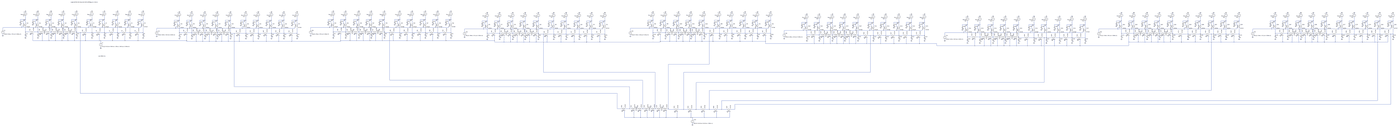
[diagram p0: schematic sambaall.asc, whole sheet]
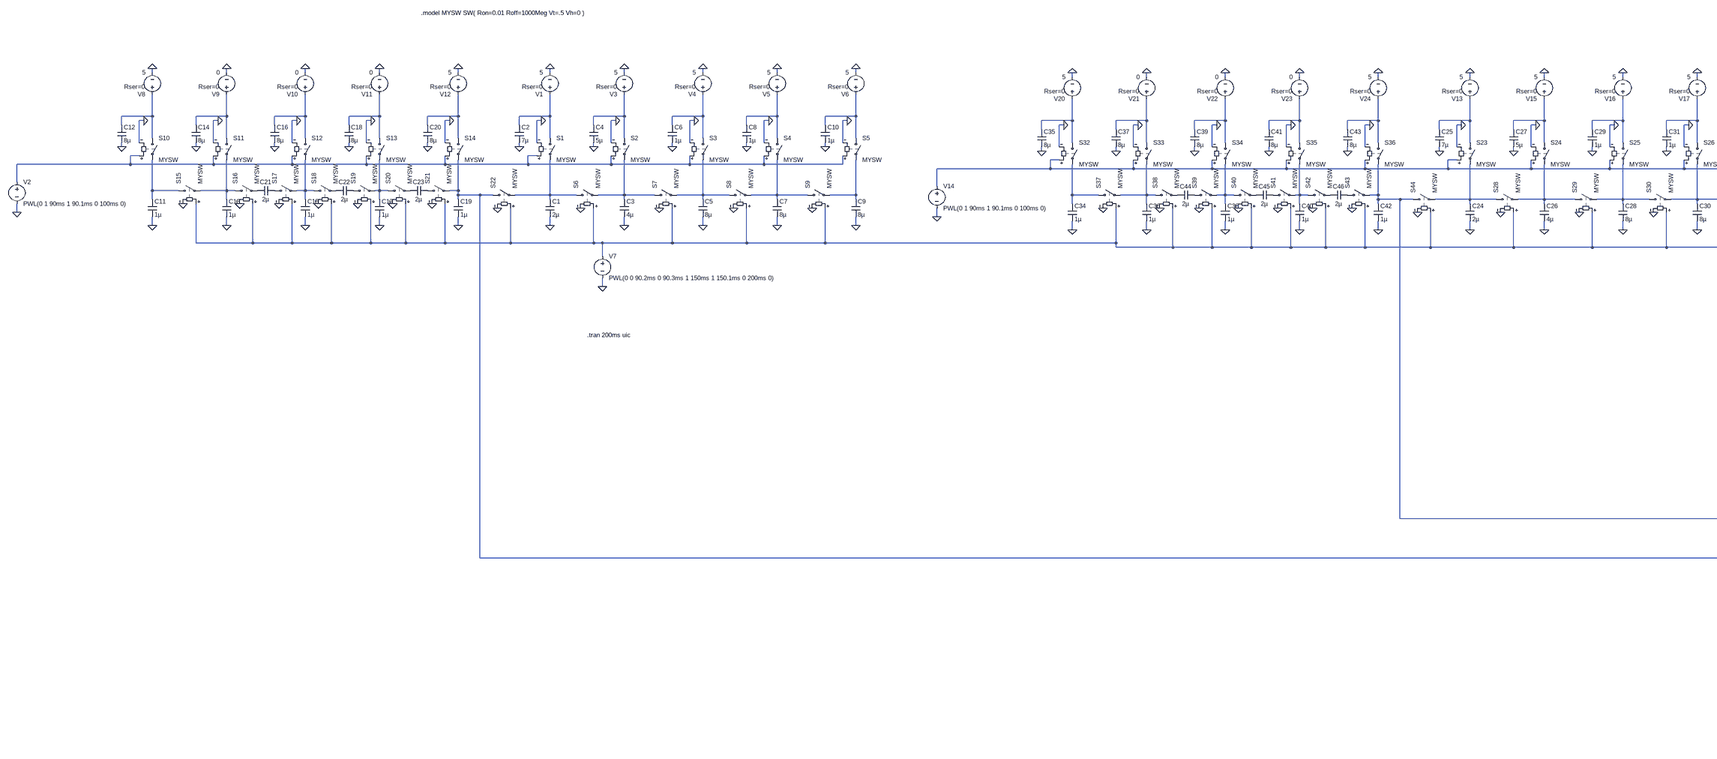
[diagram p1: schematic sambaall.asc, part, row 1 of 1, column 1 of 5]
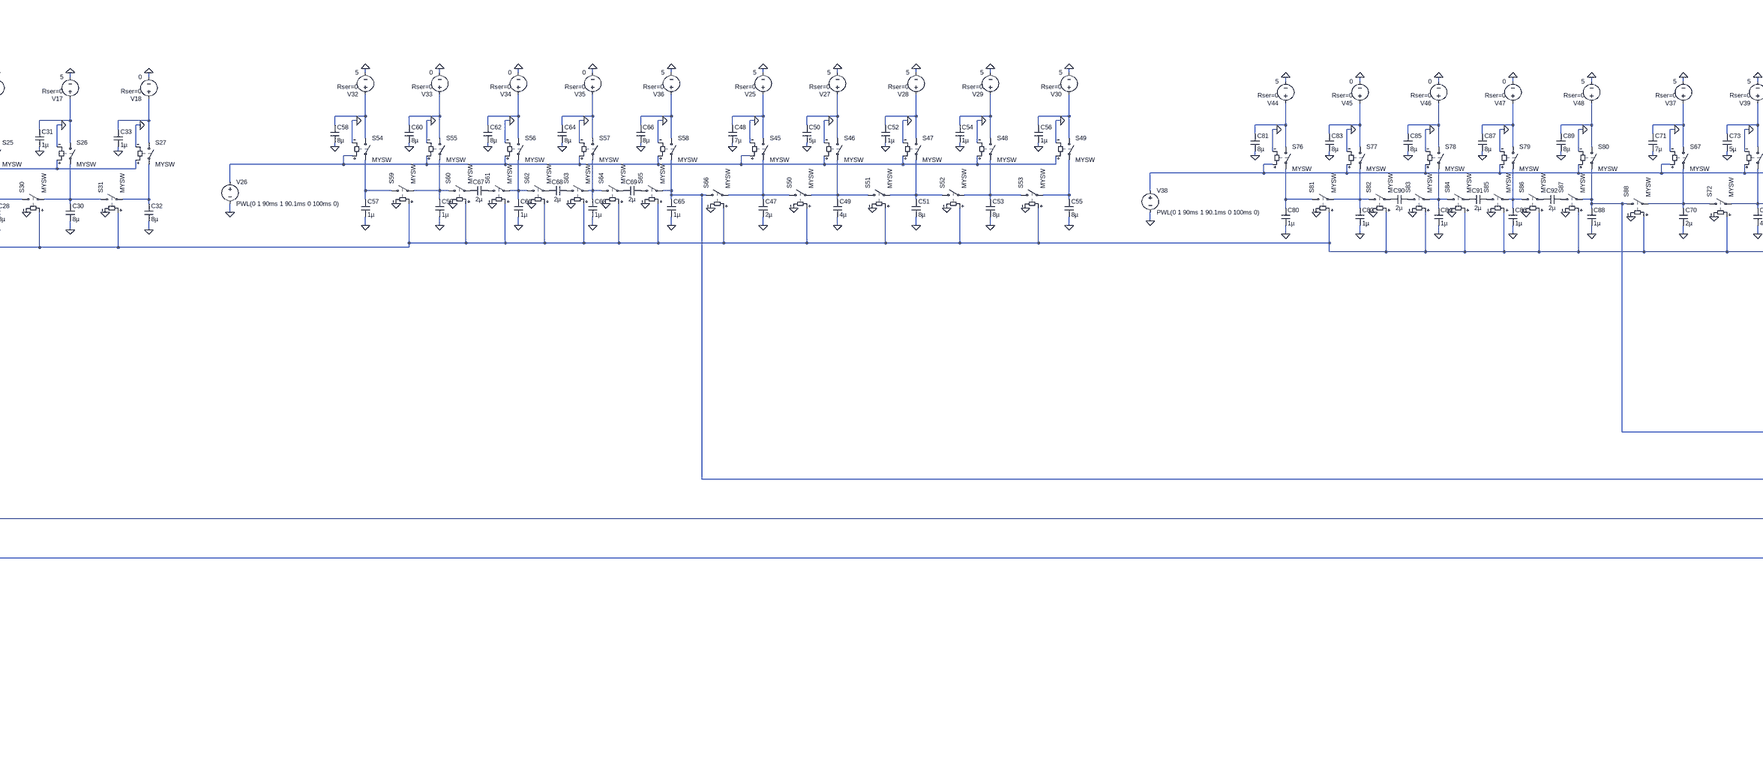
[diagram p2: schematic sambaall.asc, part, row 1 of 1, column 2 of 5]
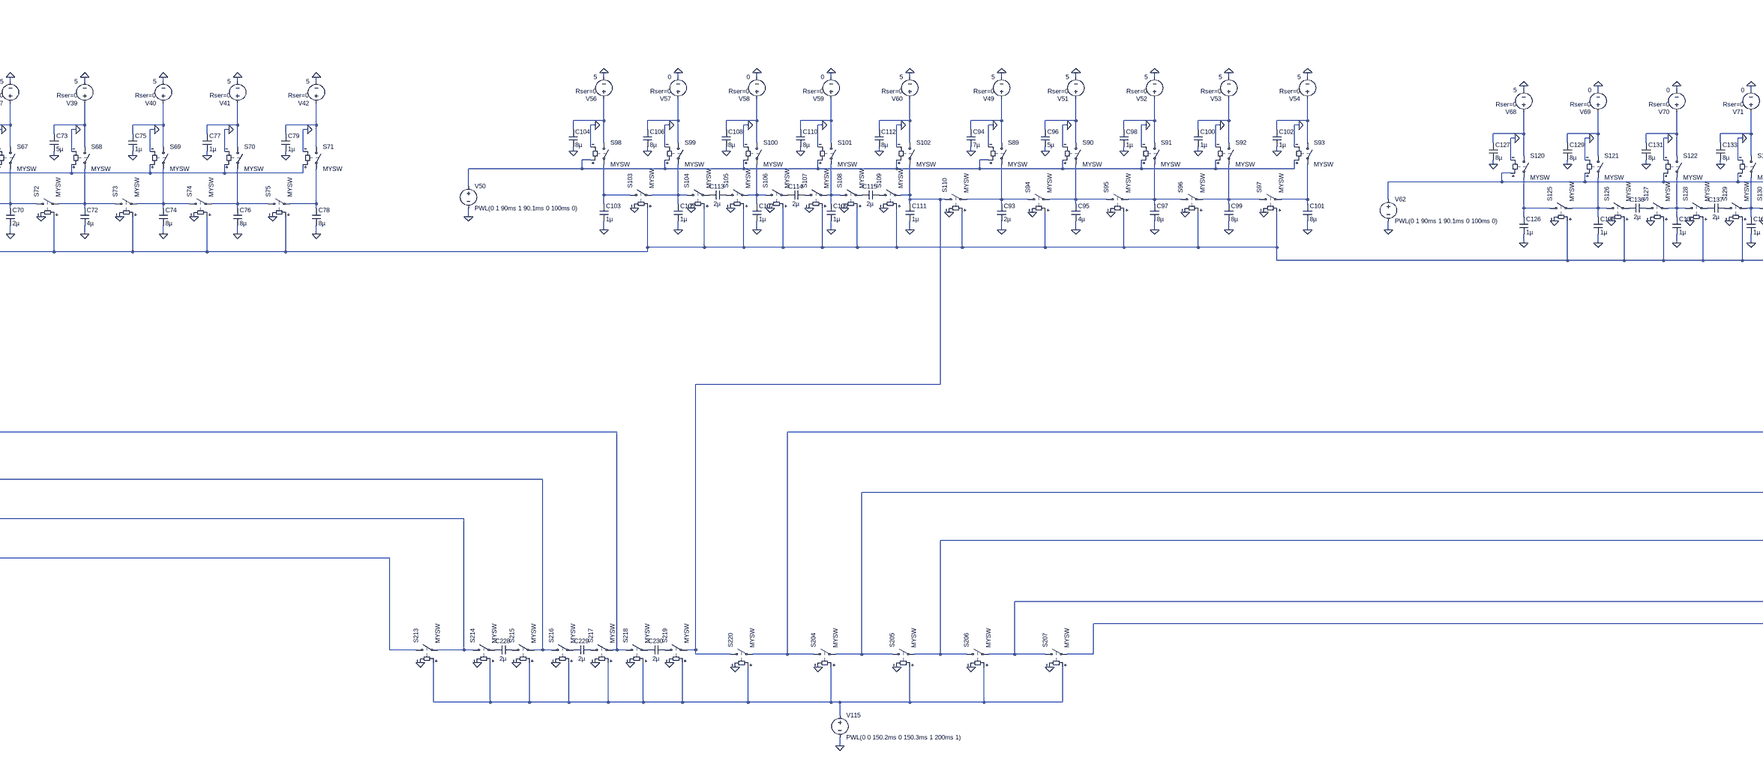
[diagram p3: schematic sambaall.asc, part, row 1 of 1, column 3 of 5]
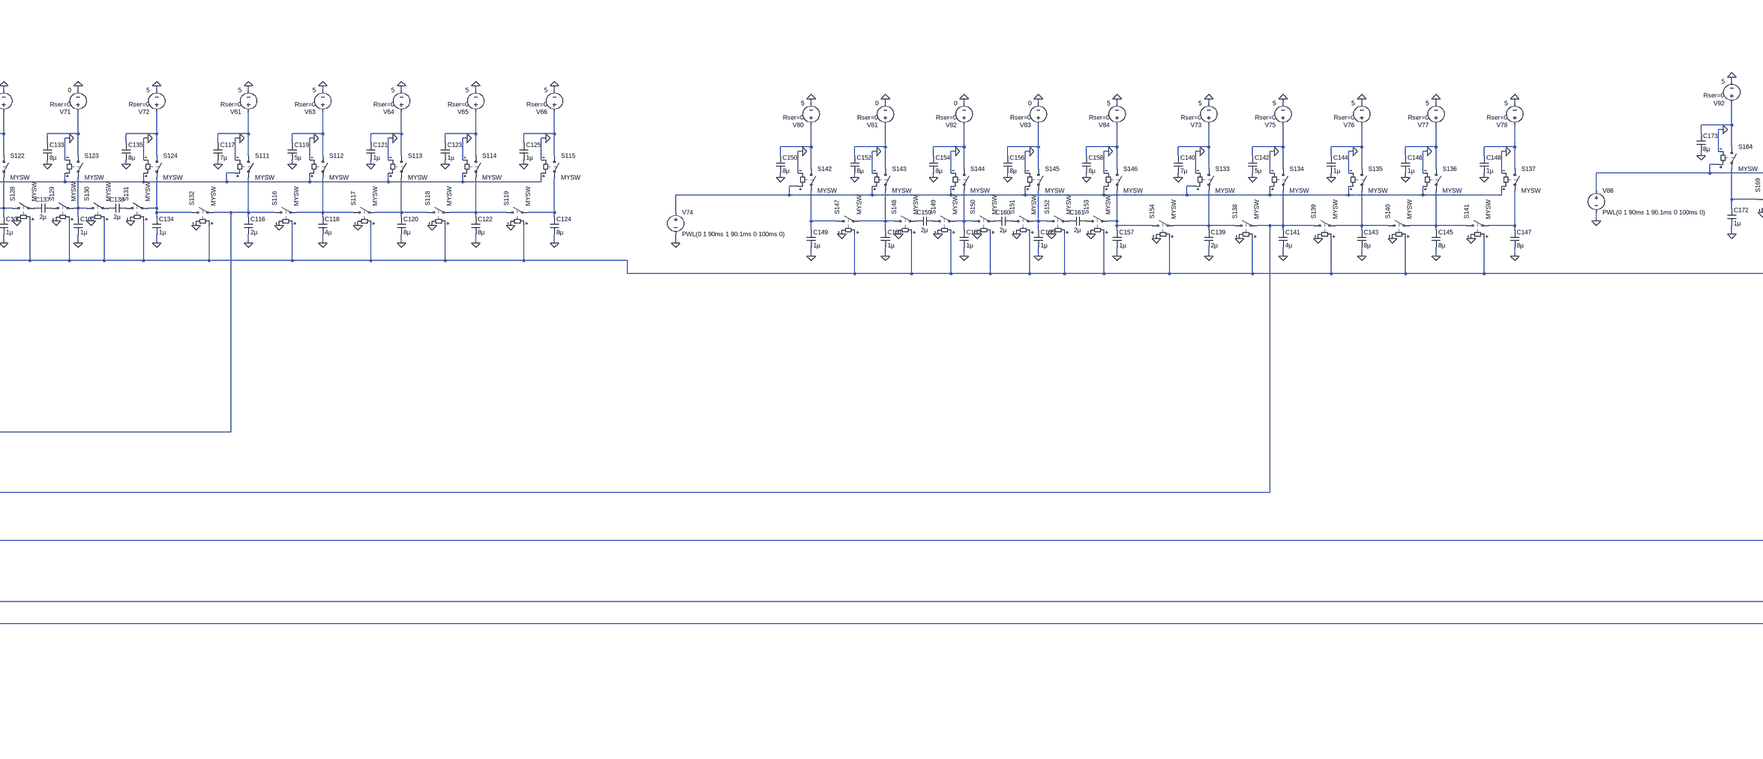
[diagram p4: schematic sambaall.asc, part, row 1 of 1, column 4 of 5]
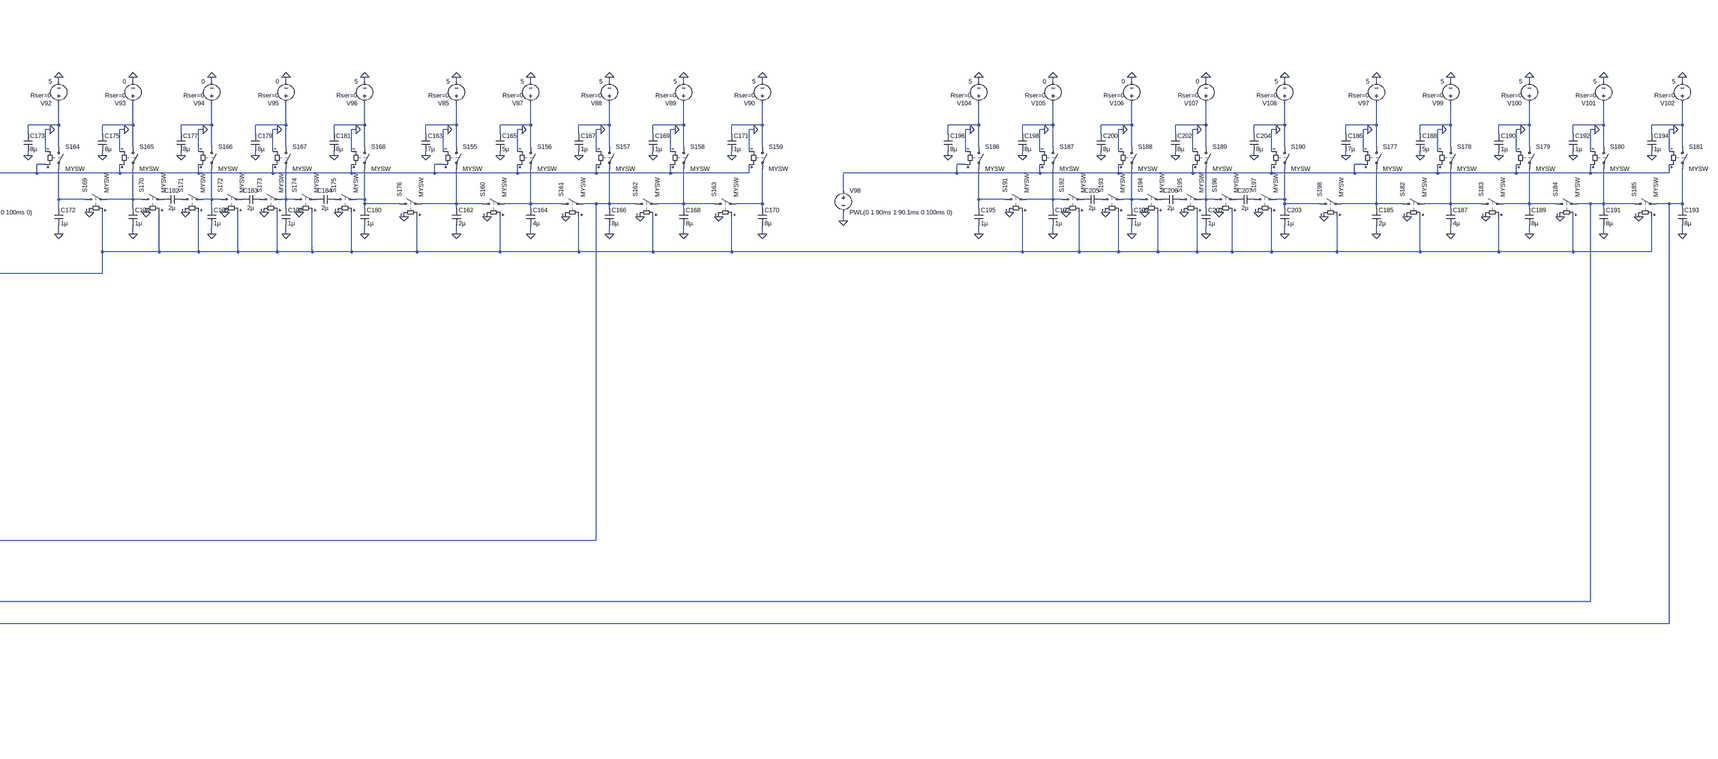
[diagram p5: schematic sambaall.asc, part, row 1 of 1, column 5 of 5]
* sambaall.asc
C1 N110 0 2µ
C2 N006 0 7µ
V1 N006 0 5 Rser=0
V2 N091 0 PWL(0 1 90ms 1 90.1ms 0 100ms 0)
S1 N006 N110 N091 0 MYSW
C3 N111 0 4µ
C4 N007 0 5µ
S2 N007 N111 N091 0 MYSW
C5 N112 0 8µ
C6 N008 0 1µ
S3 N008 N112 N091 0 MYSW
C7 N113 0 8µ
C8 N009 0 1µ
S4 N009 N113 N091 0 MYSW
C9 N114 0 8µ
C10 N010 0 1µ
S5 N010 N114 N091 0 MYSW
S6 N110 N111 N190 0 MYSW
V3 N007 0 5 Rser=0
V4 N008 0 5 Rser=0
V5 N009 0 5 Rser=0
V6 N010 0 5 Rser=0
S7 N111 N112 N190 0 MYSW
S8 N112 N113 N190 0 MYSW
S9 N113 N114 N190 0 MYSW
V7 N190 0 PWL(0 0 90.2ms 0 90.3ms 1 150ms 1 150.1ms 0 200ms 0)
C11 N100 0 1µ
C12 N001 0 8µ
V8 N001 0 5 Rser=0
S10 N001 N100 N091 0 MYSW
C13 N101 0 1µ
C14 N002 0 8µ
S11 N002 N101 N091 0 MYSW
C15 N102 0 1µ
C16 N003 0 8µ
S12 N003 N102 N091 0 MYSW
C17 N103 0 1µ
C18 N004 0 8µ
S13 N004 N103 N091 0 MYSW
C19 N104 0 1µ
C20 N005 0 8µ
S14 N005 N104 N091 0 MYSW
S15 N100 N101 N190 0 MYSW
V9 N002 0 0 Rser=0
V10 N003 0 0 Rser=0
V11 N004 0 0 Rser=0
V12 N005 0 5 Rser=0
S16 N101 P001 N190 0 MYSW
C21 P002 P001 2µ
S17 P002 N102 N190 0 MYSW
S18 N102 P003 N190 0 MYSW
C22 P004 P003 2µ
S19 P004 N103 N190 0 MYSW
S20 N103 P005 N190 0 MYSW
C23 P006 P005 2µ
S21 P006 N104 N190 0 MYSW
S22 N104 N110 N190 0 MYSW
C24 N130 0 2µ
C25 N026 0 7µ
V13 N026 0 5 Rser=0
V14 N093 0 PWL(0 1 90ms 1 90.1ms 0 100ms 0)
S23 N026 N130 N093 0 MYSW
C26 N131 0 4µ
C27 N027 0 5µ
S24 N027 N131 N093 0 MYSW
C28 N132 0 8µ
C29 N028 0 1µ
S25 N028 N132 N093 0 MYSW
C30 N133 0 8µ
C31 N029 0 1µ
S26 N029 N133 N093 0 MYSW
C32 N134 0 8µ
C33 N030 0 1µ
S27 N030 N134 N093 0 MYSW
S28 N130 N131 N190 0 MYSW
V15 N027 0 5 Rser=0
V16 N028 0 5 Rser=0
V17 N029 0 5 Rser=0
V18 N030 0 0 Rser=0
S29 N131 N132 N190 0 MYSW
S30 N132 N133 N190 0 MYSW
S31 N133 N134 N190 0 MYSW
C34 N115 0 1µ
C35 N021 0 8µ
V20 N021 0 5 Rser=0
S32 N021 N115 N093 0 MYSW
C36 N116 0 1µ
C37 N022 0 8µ
S33 N022 N116 N093 0 MYSW
C38 N117 0 1µ
C39 N023 0 8µ
S34 N023 N117 N093 0 MYSW
C40 N118 0 1µ
C41 N024 0 8µ
S35 N024 N118 N093 0 MYSW
C42 N119 0 1µ
C43 N025 0 8µ
S36 N025 N119 N093 0 MYSW
S37 N115 N116 N190 0 MYSW
V21 N022 0 0 Rser=0
V22 N023 0 0 Rser=0
V23 N024 0 0 Rser=0
V24 N025 0 5 Rser=0
S38 N116 P007 N190 0 MYSW
C44 P008 P007 2µ
S39 P008 N117 N190 0 MYSW
S40 N117 P009 N190 0 MYSW
C45 P010 P009 2µ
S41 P010 N118 N190 0 MYSW
S42 N118 P011 N190 0 MYSW
C46 P012 P011 2µ
S43 P012 N119 N190 0 MYSW
S44 N119 N130 N190 0 MYSW
C47 N120 0 2µ
C48 N016 0 7µ
V25 N016 0 5 Rser=0
V26 N092 0 PWL(0 1 90ms 1 90.1ms 0 100ms 0)
S45 N016 N120 N092 0 MYSW
C49 N121 0 4µ
C50 N017 0 5µ
S46 N017 N121 N092 0 MYSW
C51 N122 0 8µ
C52 N018 0 1µ
S47 N018 N122 N092 0 MYSW
C53 N123 0 8µ
C54 N019 0 1µ
S48 N019 N123 N092 0 MYSW
C55 N124 0 8µ
C56 N020 0 1µ
S49 N020 N124 N092 0 MYSW
S50 N120 N121 N190 0 MYSW
V27 N017 0 5 Rser=0
V28 N018 0 5 Rser=0
V29 N019 0 5 Rser=0
V30 N020 0 5 Rser=0
S51 N121 N122 N190 0 MYSW
S52 N122 N123 N190 0 MYSW
S53 N123 N124 N190 0 MYSW
C57 N105 0 1µ
C58 N011 0 8µ
V32 N011 0 5 Rser=0
S54 N011 N105 N092 0 MYSW
C59 N106 0 1µ
C60 N012 0 8µ
S55 N012 N106 N092 0 MYSW
C61 N107 0 1µ
C62 N013 0 8µ
S56 N013 N107 N092 0 MYSW
C63 N108 0 1µ
C64 N014 0 8µ
S57 N014 N108 N092 0 MYSW
C65 N109 0 1µ
C66 N015 0 8µ
S58 N015 N109 N092 0 MYSW
S59 N105 N106 N190 0 MYSW
V33 N012 0 0 Rser=0
V34 N013 0 0 Rser=0
V35 N014 0 0 Rser=0
V36 N015 0 5 Rser=0
S60 N106 P013 N190 0 MYSW
C67 P014 P013 2µ
S61 P014 N107 N190 0 MYSW
S62 N107 P015 N190 0 MYSW
C68 P016 P015 2µ
S63 P016 N108 N190 0 MYSW
S64 N108 P017 N190 0 MYSW
C69 P018 P017 2µ
S65 P018 N109 N190 0 MYSW
S66 N109 N120 N190 0 MYSW
C70 N155 0 2µ
C71 N046 0 7µ
V37 N046 0 5 Rser=0
V38 N095 0 PWL(0 1 90ms 1 90.1ms 0 100ms 0)
S67 N046 N155 N095 0 MYSW
C72 N156 0 4µ
C73 N047 0 5µ
S68 N047 N156 N095 0 MYSW
C74 N157 0 8µ
C75 N048 0 1µ
S69 N048 N157 N095 0 MYSW
C76 N158 0 8µ
C77 N049 0 1µ
S70 N049 N158 N095 0 MYSW
C78 N159 0 8µ
C79 N050 0 1µ
S71 N050 N159 N095 0 MYSW
S72 N155 N156 N190 0 MYSW
V39 N047 0 5 Rser=0
V40 N048 0 5 Rser=0
V41 N049 0 5 Rser=0
V42 N050 0 5 Rser=0
S73 N156 N157 N190 0 MYSW
S74 N157 N158 N190 0 MYSW
S75 N158 N159 N190 0 MYSW
C80 N135 0 1µ
C81 N041 0 8µ
V44 N041 0 5 Rser=0
S76 N041 N135 N095 0 MYSW
C82 N136 0 1µ
C83 N042 0 8µ
S77 N042 N136 N095 0 MYSW
C84 N137 0 1µ
C85 N043 0 8µ
S78 N043 N137 N095 0 MYSW
C86 N138 0 1µ
C87 N044 0 8µ
S79 N044 N138 N095 0 MYSW
C88 N139 0 1µ
C89 N045 0 8µ
S80 N045 N139 N095 0 MYSW
S81 N135 N136 N190 0 MYSW
V45 N042 0 0 Rser=0
V46 N043 0 0 Rser=0
V47 N044 0 0 Rser=0
V48 N045 0 5 Rser=0
S82 N136 P019 N190 0 MYSW
C90 P020 P019 2µ
S83 P020 N137 N190 0 MYSW
S84 N137 P021 N190 0 MYSW
C91 P022 P021 2µ
S85 P022 N138 N190 0 MYSW
S86 N138 P023 N190 0 MYSW
C92 P024 P023 2µ
S87 P024 N139 N190 0 MYSW
S88 N139 N155 N190 0 MYSW
C93 N140 0 2µ
C94 N036 0 7µ
V49 N036 0 5 Rser=0
V50 N094 0 PWL(0 1 90ms 1 90.1ms 0 100ms 0)
S89 N036 N140 N094 0 MYSW
C95 N141 0 4µ
C96 N037 0 5µ
S90 N037 N141 N094 0 MYSW
C97 N142 0 8µ
C98 N038 0 1µ
S91 N038 N142 N094 0 MYSW
C99 N143 0 8µ
C100 N039 0 1µ
S92 N039 N143 N094 0 MYSW
C101 N144 0 8µ
C102 N040 0 1µ
S93 N040 N144 N094 0 MYSW
S94 N140 N141 N190 0 MYSW
V51 N037 0 5 Rser=0
V52 N038 0 5 Rser=0
V53 N039 0 5 Rser=0
V54 N040 0 5 Rser=0
S95 N141 N142 N190 0 MYSW
S96 N142 N143 N190 0 MYSW
S97 N143 N144 N190 0 MYSW
C103 N125 0 1µ
C104 N031 0 8µ
V56 N031 0 5 Rser=0
S98 N031 N125 N094 0 MYSW
C105 N126 0 1µ
C106 N032 0 8µ
S99 N032 N126 N094 0 MYSW
C107 N127 0 1µ
C108 N033 0 8µ
S100 N033 N127 N094 0 MYSW
C109 N128 0 1µ
C110 N034 0 8µ
S101 N034 N128 N094 0 MYSW
C111 N129 0 1µ
C112 N035 0 8µ
S102 N035 N129 N094 0 MYSW
S103 N125 N126 N190 0 MYSW
V57 N032 0 0 Rser=0
V58 N033 0 0 Rser=0
V59 N034 0 0 Rser=0
V60 N035 0 5 Rser=0
S104 N126 P025 N190 0 MYSW
C113 P026 P025 2µ
S105 P026 N127 N190 0 MYSW
S106 N127 P027 N190 0 MYSW
C114 P028 P027 2µ
S107 P028 N128 N190 0 MYSW
S108 N128 P029 N190 0 MYSW
C115 P030 P029 2µ
S109 P030 N129 N190 0 MYSW
S110 N129 N140 N190 0 MYSW
C116 N175 0 2µ
C117 N076 0 7µ
V61 N076 0 5 Rser=0
V62 N098 0 PWL(0 1 90ms 1 90.1ms 0 100ms 0)
S111 N076 N175 N098 0 MYSW
C118 N176 0 4µ
C119 N077 0 5µ
S112 N077 N176 N098 0 MYSW
C120 N177 0 8µ
C121 N078 0 1µ
S113 N078 N177 N098 0 MYSW
C122 N178 0 8µ
C123 N079 0 1µ
S114 N079 N178 N098 0 MYSW
C124 N179 0 8µ
C125 N080 0 1µ
S115 N080 N179 N098 0 MYSW
S116 N175 N176 N190 0 MYSW
V63 N077 0 5 Rser=0
V64 N078 0 5 Rser=0
V65 N079 0 5 Rser=0
V66 N080 0 5 Rser=0
S117 N176 N177 N190 0 MYSW
S118 N177 N178 N190 0 MYSW
S119 N178 N179 N190 0 MYSW
C126 N170 0 1µ
C127 N071 0 8µ
V68 N071 0 5 Rser=0
S120 N071 N170 N098 0 MYSW
C128 N171 0 1µ
C129 N072 0 8µ
S121 N072 N171 N098 0 MYSW
C130 N172 0 1µ
C131 N073 0 8µ
S122 N073 N172 N098 0 MYSW
C132 N173 0 1µ
C133 N074 0 8µ
S123 N074 N173 N098 0 MYSW
C134 N174 0 1µ
C135 N075 0 8µ
S124 N075 N174 N098 0 MYSW
S125 N170 N171 N190 0 MYSW
V69 N072 0 0 Rser=0
V70 N073 0 0 Rser=0
V71 N074 0 0 Rser=0
V72 N075 0 5 Rser=0
S126 N171 P031 N190 0 MYSW
C136 P032 P031 2µ
S127 P032 N172 N190 0 MYSW
S128 N172 P033 N190 0 MYSW
C137 P034 P033 2µ
S129 P034 N173 N190 0 MYSW
S130 N173 P035 N190 0 MYSW
C138 P036 P035 2µ
S131 P036 N174 N190 0 MYSW
S132 N174 N175 N190 0 MYSW
C139 N185 0 2µ
C140 N086 0 7µ
V73 N086 0 5 Rser=0
V74 N099 0 PWL(0 1 90ms 1 90.1ms 0 100ms 0)
S133 N086 N185 N099 0 MYSW
C141 N186 0 4µ
C142 N087 0 5µ
S134 N087 N186 N099 0 MYSW
C143 N187 0 8µ
C144 N088 0 1µ
S135 N088 N187 N099 0 MYSW
C145 N188 0 8µ
C146 N089 0 1µ
S136 N089 N188 N099 0 MYSW
C147 N189 0 8µ
C148 N090 0 1µ
S137 N090 N189 N099 0 MYSW
S138 N185 N186 N190 0 MYSW
V75 N087 0 5 Rser=0
V76 N088 0 5 Rser=0
V77 N089 0 5 Rser=0
V78 N090 0 5 Rser=0
S139 N186 N187 N190 0 MYSW
S140 N187 N188 N190 0 MYSW
S141 N188 N189 N190 0 MYSW
C149 N180 0 1µ
C150 N081 0 8µ
V80 N081 0 5 Rser=0
S142 N081 N180 N099 0 MYSW
C151 N181 0 1µ
C152 N082 0 8µ
S143 N082 N181 N099 0 MYSW
C153 N182 0 1µ
C154 N083 0 8µ
S144 N083 N182 N099 0 MYSW
C155 N183 0 1µ
C156 N084 0 8µ
S145 N084 N183 N099 0 MYSW
C157 N184 0 1µ
C158 N085 0 8µ
S146 N085 N184 N099 0 MYSW
S147 N180 N181 N190 0 MYSW
V81 N082 0 0 Rser=0
V82 N083 0 0 Rser=0
V83 N084 0 0 Rser=0
V84 N085 0 5 Rser=0
S148 N181 P037 N190 0 MYSW
C159 P038 P037 2µ
S149 P038 N182 N190 0 MYSW
S150 N182 P039 N190 0 MYSW
C160 P040 P039 2µ
S151 P040 N183 N190 0 MYSW
S152 N183 P041 N190 0 MYSW
C161 P042 P041 2µ
S153 P042 N184 N190 0 MYSW
S154 N184 N185 N190 0 MYSW
C162 N160 0 2µ
C163 N056 0 7µ
V85 N056 0 5 Rser=0
V86 N096 0 PWL(0 1 90ms 1 90.1ms 0 100ms 0)
S155 N056 N160 N096 0 MYSW
C164 N161 0 4µ
C165 N057 0 5µ
S156 N057 N161 N096 0 MYSW
C166 N162 0 8µ
C167 N058 0 1µ
S157 N058 N162 N096 0 MYSW
C168 N163 0 8µ
C169 N059 0 1µ
S158 N059 N163 N096 0 MYSW
C170 N164 0 8µ
C171 N060 0 1µ
S159 N060 N164 N096 0 MYSW
S160 N160 N161 N190 0 MYSW
V87 N057 0 5 Rser=0
V88 N058 0 5 Rser=0
V89 N059 0 5 Rser=0
V90 N060 0 5 Rser=0
S161 N161 N162 N190 0 MYSW
S162 N162 N163 N190 0 MYSW
S163 N163 N164 N190 0 MYSW
C172 N145 0 1µ
C173 N051 0 8µ
V92 N051 0 5 Rser=0
S164 N051 N145 N096 0 MYSW
C174 N146 0 1µ
C175 N052 0 8µ
S165 N052 N146 N096 0 MYSW
C176 N147 0 1µ
C177 N053 0 8µ
S166 N053 N147 N096 0 MYSW
C178 N148 0 1µ
C179 N054 0 8µ
S167 N054 N148 N096 0 MYSW
C180 N149 0 1µ
C181 N055 0 8µ
S168 N055 N149 N096 0 MYSW
S169 N145 N146 N190 0 MYSW
V93 N052 0 0 Rser=0
V94 N053 0 0 Rser=0
V95 N054 0 0 Rser=0
V96 N055 0 5 Rser=0
S170 N146 P043 N190 0 MYSW
C182 P044 P043 2µ
S171 P044 N147 N190 0 MYSW
S172 N147 P045 N190 0 MYSW
C183 P046 P045 2µ
S173 P046 N148 N190 0 MYSW
S174 N148 P047 N190 0 MYSW
C184 P048 P047 2µ
S175 P048 N149 N190 0 MYSW
S176 N149 N160 N190 0 MYSW
C185 N165 0 2µ
C186 N066 0 7µ
V97 N066 0 5 Rser=0
V98 N097 0 PWL(0 1 90ms 1 90.1ms 0 100ms 0)
S177 N066 N165 N097 0 MYSW
C187 N166 0 4µ
C188 N067 0 5µ
S178 N067 N166 N097 0 MYSW
C189 N167 0 8µ
C190 N068 0 1µ
S179 N068 N167 N097 0 MYSW
C191 N168 0 8µ
C192 N069 0 1µ
S180 N069 N168 N097 0 MYSW
C193 N169 0 8µ
C194 N070 0 1µ
S181 N070 N169 N097 0 MYSW
S182 N165 N166 N190 0 MYSW
V99 N067 0 5 Rser=0
V100 N068 0 5 Rser=0
V101 N069 0 5 Rser=0
V102 N070 0 5 Rser=0
S183 N166 N167 N190 0 MYSW
S184 N167 N168 N190 0 MYSW
S185 N168 N169 N190 0 MYSW
C195 N150 0 1µ
C196 N061 0 8µ
V104 N061 0 5 Rser=0
S186 N061 N150 N097 0 MYSW
C197 N151 0 1µ
C198 N062 0 8µ
S187 N062 N151 N097 0 MYSW
C199 N152 0 1µ
C200 N063 0 8µ
S188 N063 N152 N097 0 MYSW
C201 N153 0 1µ
C202 N064 0 8µ
S189 N064 N153 N097 0 MYSW
C203 N154 0 1µ
C204 N065 0 8µ
S190 N065 N154 N097 0 MYSW
S191 N150 N151 N190 0 MYSW
V105 N062 0 0 Rser=0
V106 N063 0 0 Rser=0
V107 N064 0 0 Rser=0
V108 N065 0 5 Rser=0
S192 N151 P049 N190 0 MYSW
C205 P050 P049 2µ
S193 P050 N152 N190 0 MYSW
S194 N152 P051 N190 0 MYSW
C206 P052 P051 2µ
S195 P052 N153 N190 0 MYSW
S196 N153 P053 N190 0 MYSW
C207 P054 P053 2µ
S197 P054 N154 N190 0 MYSW
S198 N154 N165 N190 0 MYSW
S204 N175 N186 N191 0 MYSW
S205 N186 N162 N191 0 MYSW
S206 N162 N168 N191 0 MYSW
S207 N168 N169 N191 0 MYSW
V115 N191 0 PWL(0 0 150.2ms 0 150.3ms 1 200ms 1)
S213 N104 N119 N191 0 MYSW
S214 N119 P055 N191 0 MYSW
C228 P056 P055 2µ
S215 P056 N109 N191 0 MYSW
S216 N109 P057 N191 0 MYSW
C229 P058 P057 2µ
S217 P058 N139 N191 0 MYSW
S218 N139 P059 N191 0 MYSW
C230 P060 P059 2µ
S219 P060 N129 N191 0 MYSW
S220 N129 N175 N191 0 MYSW
.tran 200ms uic
.model MYSW SW( Ron=0.01 Roff=1000Meg Vt=.5 Vh=0 )
.backanno
.end